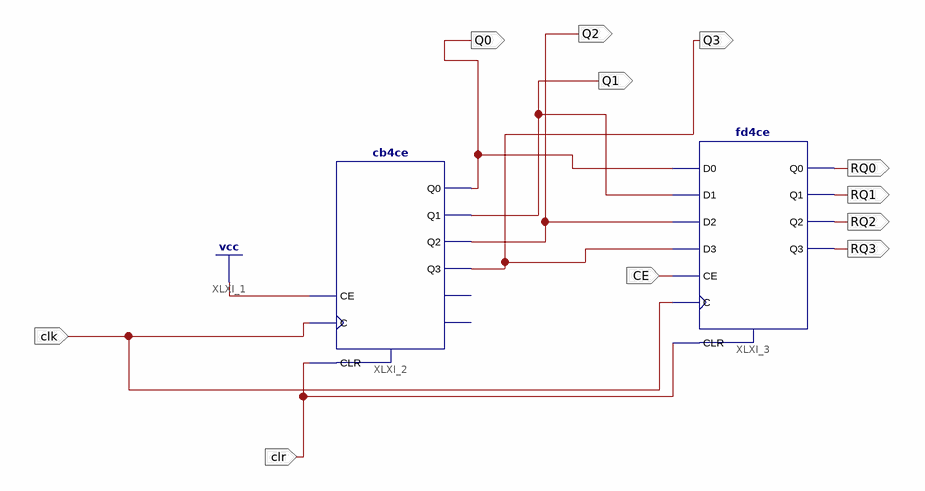
[diagram p0: schematic sheet 1]
// Xilinx ISE schematic regAndCount.sch (spartan6) as structural Verilog: 2 symbols, 11 ports
module regAndCount (
  input  clr,
  input  CE,
  input  clk,
  output RQ0,
  output RQ1,
  output RQ2,
  output RQ3,
  output Q0,
  output Q1,
  output Q2,
  output Q3
);

  cb4ce XLXI_2 (.C(clk), .CE(1'b1), .CLR(clr), .Q0(Q0), .Q1(Q1), .Q2(Q2), .Q3(Q3));  // open: CEO, TC
  fd4ce XLXI_3 (
    .C(clk), .CE(CE), .CLR(clr), .D0(Q0), .D1(Q1), .D2(Q2), .D3(Q3), .Q0(RQ0), .Q1(RQ1), .Q2(RQ2), .Q3(RQ3));
endmodule
